# EAGLE design sunclock_back (EAGLE 9.6.2)
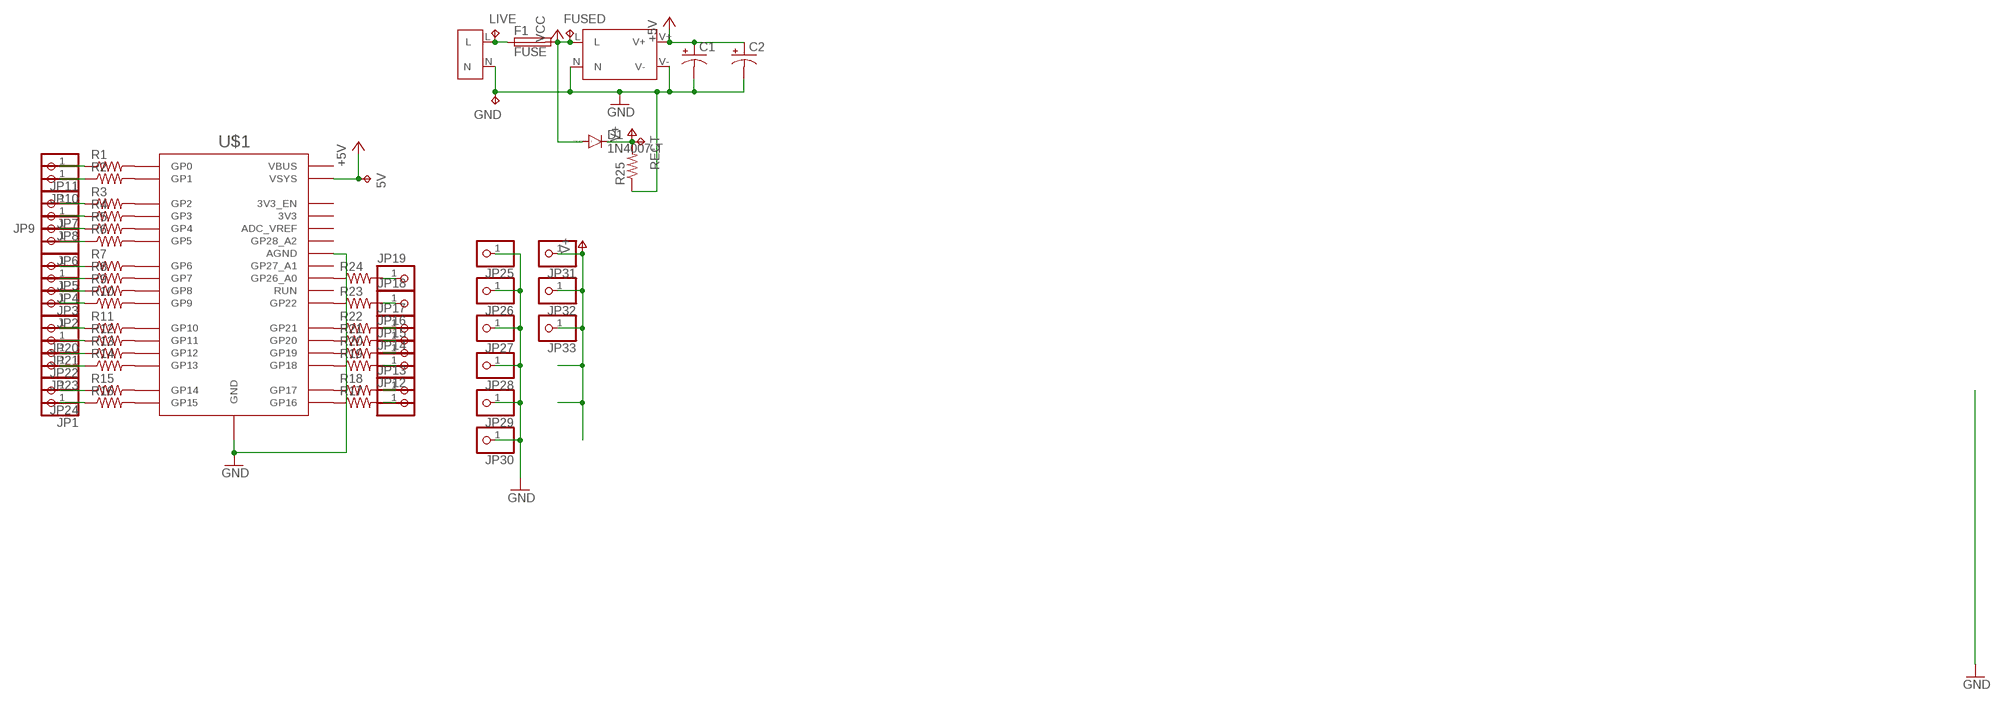
[diagram p0: schematic, sheet 1]

## Parts
5V  TPB2,54  [B2,54]
AC1  AC_IN  [AC_IN]
C1  CPOL-USE3.5-10  [E3,5-10]
C2  CPOL-USE3.5-10  [E3,5-10]
D1  1N4007-T  [DIOAD1140W86L463D236B]
F1  FUSE  [FUSE]
FUSED  TPB2,54  [B2,54]
GND  TPB2,54  [B2,54]
JP1  PINHD-1X1  [1X01]
JP2  PINHD-1X1  [1X01]
JP3  PINHD-1X1  [1X01]
JP4  PINHD-1X1  [1X01]
JP5  PINHD-1X1  [1X01]
JP6  PINHD-1X1  [1X01]
JP7  PINHD-1X1  [1X01]
JP8  PINHD-1X1  [1X01]
JP9  PINHD-1X1  [1X01]
JP10  PINHD-1X1  [1X01]
JP11  PINHD-1X1  [1X01]
JP12  PINHD-1X1  [1X01]
JP13  PINHD-1X1  [1X01]
JP14  PINHD-1X1  [1X01]
JP15  PINHD-1X1  [1X01]
JP16  PINHD-1X1  [1X01]
JP17  PINHD-1X1  [1X01]
JP18  PINHD-1X1  [1X01]
JP19  PINHD-1X1  [1X01]
JP20  PINHD-1X1  [1X01]
JP21  PINHD-1X1  [1X01]
JP22  PINHD-1X1  [1X01]
JP23  PINHD-1X1  [1X01]
JP24  PINHD-1X1  [1X01]
JP25  PINHD-1X1  [1X01]
JP26  PINHD-1X1  [1X01]
JP27  PINHD-1X1  [1X01]
JP28  PINHD-1X1  [1X01]
JP29  PINHD-1X1  [1X01]
JP30  PINHD-1X1  [1X01]
JP31  PINHD-1X1  [1X01]
JP32  PINHD-1X1  [1X01]
JP33  PINHD-1X1  [1X01]
LIVE  TPB2,54  [B2,54]
P1  ACDC  [ACDC]
R1  R-US_0204/7  [0204/7]
R2  R-US_0204/7  [0204/7]
R3  R-US_0204/7  [0204/7]
R4  R-US_0204/7  [0204/7]
R5  R-US_0204/7  [0204/7]
R6  R-US_0204/7  [0204/7]
R7  R-US_0204/7  [0204/7]
R8  R-US_0204/7  [0204/7]
R9  R-US_0204/7  [0204/7]
R10  R-US_0204/7  [0204/7]
R11  R-US_0204/7  [0204/7]
R12  R-US_0204/7  [0204/7]
R13  R-US_0204/7  [0204/7]
R14  R-US_0204/7  [0204/7]
R15  R-US_0204/7  [0204/7]
R16  R-US_0204/7  [0204/7]
R17  R-US_0204/7  [0204/7]
R18  R-US_0204/7  [0204/7]
R19  R-US_0204/7  [0204/7]
R20  R-US_0204/7  [0204/7]
R21  R-US_0204/7  [0204/7]
R22  R-US_0204/7  [0204/7]
R23  R-US_0204/7  [0204/7]
R24  R-US_0204/7  [0204/7]
R25  R-US_0204/7  [0204/7]
RECT  TPB2,54  [B2,54]
U$1  RPI_PICO-TH  [RPI_PICO_TH]

## Nets
+5V: 5V.TP C1.+ C2.+ P1.V+ U$1.VSYS
GND: AC1.N C1.- C2.- GND.TP JP25.1 JP26.1 JP27.1 JP28.1 JP29.1 JP30.1 P1.N P1.V- R25.1 U$1.AGND U$1.GND@1(GND) U$1.GND@2(GND) U$1.GND@3(GND) U$1.GND@4(GND) U$1.GND@6(GND) U$1.GND@7(GND) U$1.GND@8(GND)
N$1: R1.2 U$1.GP0
N$2: R2.2 U$1.GP1
N$3: R3.2 U$1.GP2
N$4: R4.2 U$1.GP3
N$5: R5.2 U$1.GP4
N$6: R6.2 U$1.GP5
N$7: R7.2 U$1.GP6
N$8: R8.2 U$1.GP7
N$9: R9.2 U$1.GP8
N$10: R10.2 U$1.GP9
N$11: R11.2 U$1.GP10
N$12: R12.2 U$1.GP11
N$13: R13.2 U$1.GP12
N$14: R14.2 U$1.GP13
N$15: R15.2 U$1.GP14
N$16: R16.2 U$1.GP15
N$17: R17.1 U$1.GP16
N$18: R18.1 U$1.GP17
N$19: R19.1 U$1.GP18
N$20: R20.1 U$1.GP19
N$21: R21.1 U$1.GP20
N$22: R22.1 U$1.GP21
N$23: R23.1 U$1.GP22
N$24: R24.1 U$1.GP26_A0
N$25: JP9.1 R5.1
N$26: JP8.1 R4.1
N$27: JP7.1 R3.1
N$28: JP10.1 R2.1
N$29: JP11.1 R1.1
N$30: JP6.1 R6.1
N$31: JP5.1 R7.1
N$32: JP4.1 R8.1
N$33: JP3.1 R9.1
N$34: JP2.1 R10.1
N$35: JP1.1 R16.1
N$36: JP20.1 R11.1
N$37: JP21.1 R12.1
N$38: JP22.1 R13.1
N$39: JP23.1 R14.1
N$40: JP24.1 R15.1
N$41: JP12.1 R17.2
N$42: JP13.1 R18.2
N$43: JP14.1 R19.2
N$44: JP15.1 R20.2
N$45: JP16.1 R21.2
N$46: JP17.1 R22.2
N$47: JP18.1 R23.2
N$48: JP19.1 R24.2
N$49: AC1.L F1.P$1 LIVE.TP
V+: D1.1(C) JP31.1 JP32.1 JP33.1 R25.2 RECT.TP
VCC: D1.2(A) F1.P$2 FUSED.TP P1.L
Unconnected: U$1.3V3 U$1.3V3_EN U$1.ADC_VREF U$1.GP27_A1 U$1.GP28_A2 U$1.RUN U$1.VBUS

## Library data of the parts
5V FUSED GND LIVE RECT = testpad:TP: Test pad
AC1 = 1826899:AC_IN
C1 C2 = rcl:CPOL-US: POLARIZED CAPACITOR, American symbol; SPICEPREFIX: C
D1 = 1826899:1N4007-T
F1 = 1826899:FUSE
JP1-JP33 = pinhead:PINHD-1X1: PIN HEADER
P1 = 1826899:ACDC
R1-R25 = rcl:R-US_: RESISTOR, American symbol; SPICEPREFIX: R
U$1 = 1826899:RPI_PICO

## Board
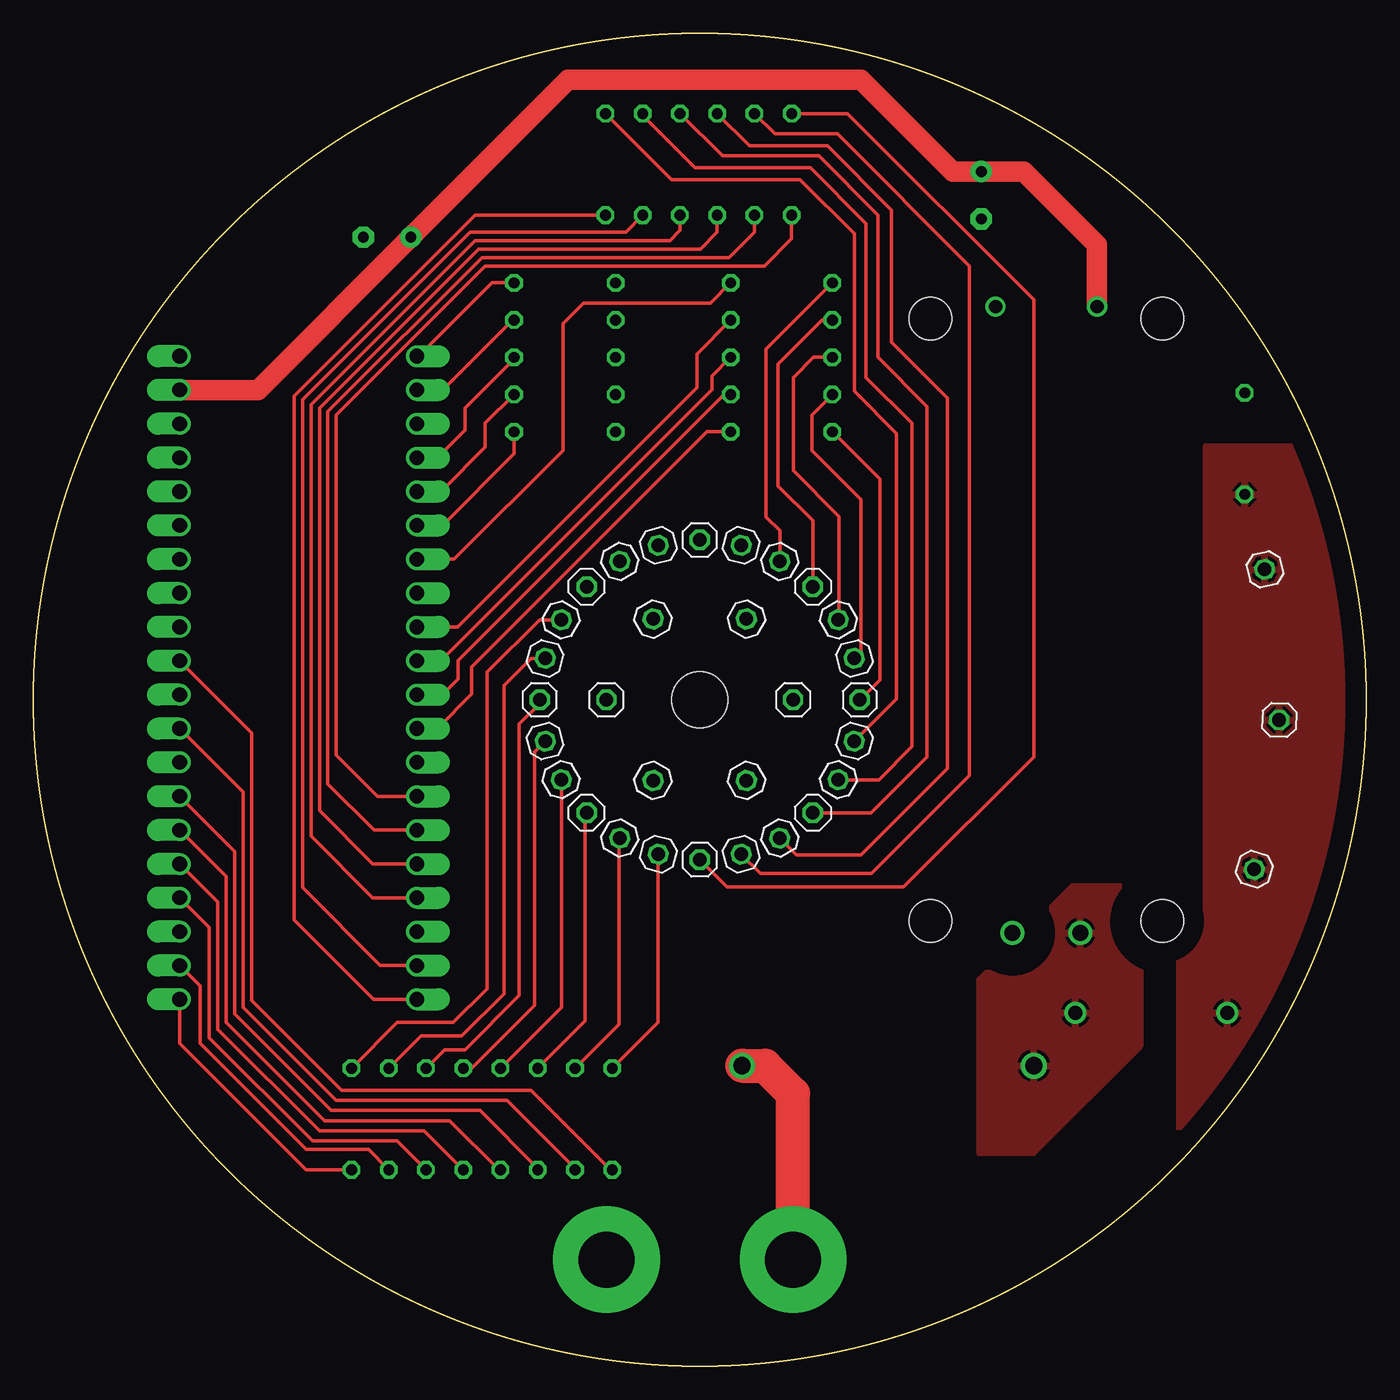
[diagram p1: board, top side]
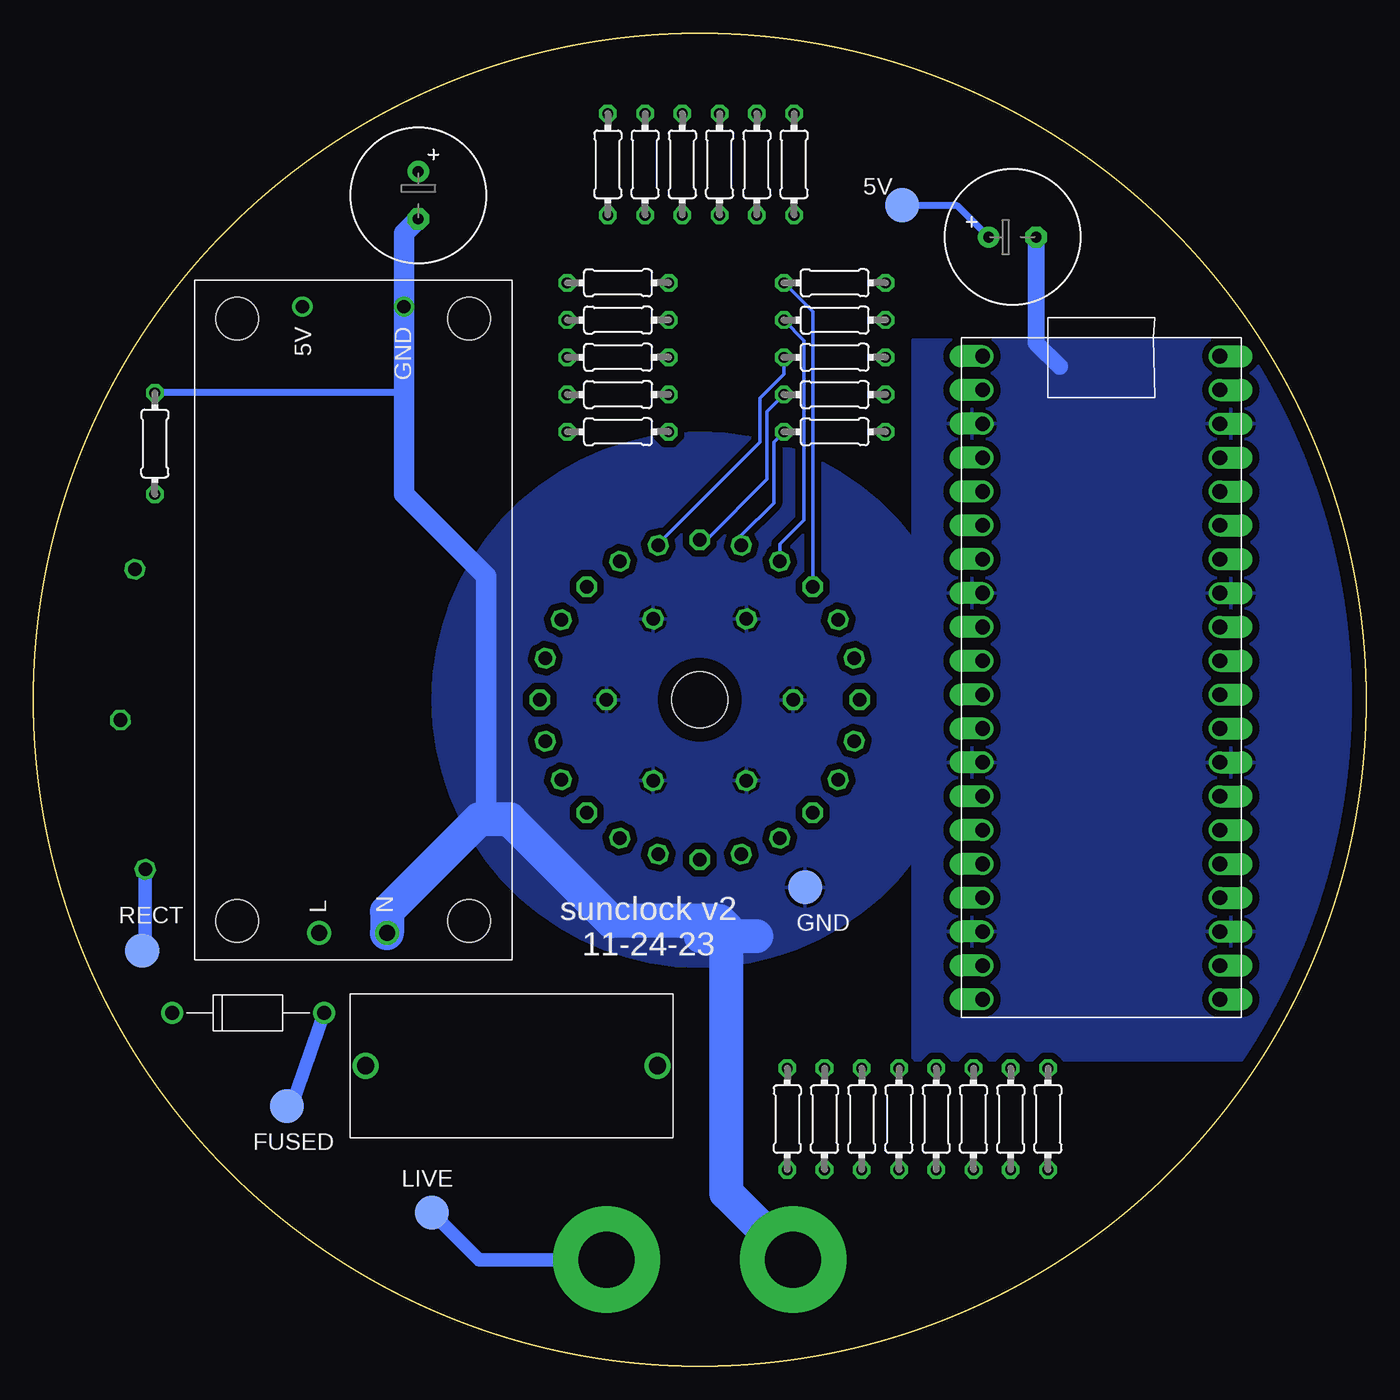
[diagram p2: board, bottom side, seen from below]

Size 100 x 100 mm. Coordinates in mm from the lower left corner, seen from the top.
Outline: circle at 50,50 radius 50
Copper layers (1*16): Top 0.035mm / dielectric 1.5mm / Bottom 0.035mm
Design rules "default": minimum track width 6mil, minimum drill 0.35mm, track to track 6mil, track to pad 6mil, pad to pad 6mil, via to via 6mil, smd to smd 6mil, copper to edge 40mil, drill to drill 6mil, minimum pad ring 10mil, minimum via ring 8mil, stop-mask expansion 4mil, vias tented up to drill 0mil, thermal gap 10mil
Holes 4.2 mm at 50,50

### Footprints (pad centres in the part's own frame; a part is rotated, then mirrored left to right if it is on the bottom)
B2,54 = smd 2.54 x 2.54: TP 0,0
AC_IN = drill 4.2 pad 8: L 7,0; N -7,0
E3,5-10 = drill 0.813 pad 1.6: + -1.778,0 | drill 0.813 pad 1.6 octagon: - 1.778,0
DIOAD1140W86L463D236B = drill 1.064 pad 1.664: 1 -5.701,0; 2 5.701,0
FUSE = drill 1.3: P$1 -10.95,0; P$2 10.95,0
1X01 = drill 1.016 octagon: 1 0,0
ACDC = drill 1.2: L -23.5,2.54; N -23.5,-2.54 | drill 1: V+ 23.5,3.81; V- 23.5,-3.81 | hole 3.2: -22.6,8.7; 22.6,8.7; -22.6,-8.7; 22.6,-8.7
0204/7 = drill 0.813 octagon: 1 -3.81,0; 2 3.81,0
RPI_PICO_TH = drill 1.1 pad 1.6 offset: 3V3 8.89,13.97; 3V3_EN 8.89,16.51; ADC_VREF 8.89,11.43; AGND 8.89,6.35; GND@1 -8.89,19.05; GND@2 -8.89,6.35; GND@3 -8.89,-6.35; GND@4 -8.89,-19.05; GND@6 8.89,-19.05; GND@7 8.89,-6.35; GND@8 8.89,19.05; GP0 -8.89,24.13; GP1 -8.89,21.59; GP2 -8.89,16.51; GP3 -8.89,13.97; GP4 -8.89,11.43; GP5 -8.89,8.89; GP6 -8.89,3.81; GP7 -8.89,1.27; GP8 -8.89,-1.27; GP9 -8.89,-3.81; GP10 -8.89,-8.89; GP11 -8.89,-11.43; GP12 -8.89,-13.97; GP13 -8.89,-16.51; GP14 -8.89,-21.59; GP15 -8.89,-24.13; GP16 8.89,-24.13; GP17 8.89,-21.59; GP18 8.89,-16.51; GP19 8.89,-13.97; GP20 8.89,-11.43; GP21 8.89,-8.89; GP22 8.89,-3.81; GP26_A0 8.89,1.27; GP27_A1 8.89,3.81; GP28_A2 8.89,8.89; RUN 8.89,-1.27; VBUS 8.89,24.13; VSYS 8.89,21.59

### Placement (x,y rotation side)
5V  34.81,87.11 0 bottom
AC1  50,8 0 top
C1  26.54,84.71 0 bottom
C2  71.12,87.85 270 bottom
D1  83.89,26.5 0 bottom
F1  64.12,22.54 180 bottom
FUSED  80.99,19.5 0 bottom
GND  42.1,35.93 0 bottom
JP1  61.59,46.89 345 top
JP2  62,50 0 top
JP3  61.59,53.11 15 top
JP4  60.39,56 30 top
JP5  58.49,58.49 45 top
JP6  56,60.39 60 top
JP7  53.11,61.59 75 top
JP8  50,62 90 top
JP9  46.89,61.59 105 top
JP10  44,60.39 120 top
JP11  41.51,58.49 135 top
JP12  39.61,56 150 top
JP13  38.41,53.11 165 top
JP14  38,50 180 top
JP15  38.41,46.89 195 top
JP16  39.61,44 210 top
JP17  41.51,41.51 225 top
JP18  44,39.61 240 top
JP19  46.89,38.41 255 top
JP20  50,38 270 top
JP21  53.11,38.41 285 top
JP22  56,39.61 300 top
JP23  58.49,41.51 315 top
JP24  60.39,44 330 top
JP25  57,50 0 top
JP26  53.5,56.06 60 top
JP27  46.5,56.06 120 top
JP28  43,50 180 top
JP29  46.5,43.94 240 top
JP30  53.5,43.94 300 top
JP31  91.6,37.28 343 top
JP32  93.47,48.48 358 top
JP33  92.39,59.79 13 top
LIVE  70.1,11.54 0 bottom
P1  76,56 90 bottom
R1  39.88,81.28 0 bottom
R2  39.88,78.49 0 bottom
R3  39.88,75.69 0 bottom
R4  39.88,72.9 0 bottom
R5  39.88,70.1 0 bottom
R6  56.13,81.28 0 bottom
R7  56.13,78.49 0 bottom
R8  56.13,75.69 0 bottom
R9  56.13,72.9 0 bottom
R10  56.13,70.1 0 bottom
R11  56.9,90.17 270 bottom
R12  54.1,90.17 270 bottom
R13  51.31,90.17 270 bottom
R14  48.51,90.17 270 bottom
R15  45.72,90.17 270 bottom
R16  42.93,90.17 270 bottom
R17  23.88,18.54 90 bottom
R18  26.67,18.54 90 bottom
R19  29.46,18.54 90 bottom
R20  32.26,18.54 90 bottom
R21  35.05,18.54 90 bottom
R22  37.85,18.54 90 bottom
R23  40.64,18.54 90 bottom
R24  43.43,18.54 90 bottom
R25  90.88,69.22 270 bottom
RECT  91.83,31.16 0 bottom
U$1  19.87,51.65 0 bottom

### Tracks (layer width: path | path; a pad name or v marks a point on that pad's centre or on a via)
+5V
  Top 1.524: U$1.VSYS 16.86,73.24 C1.+ 40.13,96.52 62.1,96.52 68.99,89.63 C2.+ 74.33,89.63 79.81,84.15 P1.V+
  Bottom 0.508: 5V.TP 30.72,87.11 C1.+
GND
  Bottom 0.508: R25.1 90.85,73.06 72.19,73.06
  Bottom 1.27: C1.- 24.77,76.77 23,75
  Bottom 1.524: 66.55,41.02 66.04,41.53 66.04,59.29 72.19,65.44 72.19,73.06 P1.V- 72.19,85 C2.-
  Bottom 2.54: AC1.N 48.01,13.01 48.01,32.89 48.51,33.4 56.64,33.4 64.26,41.02 66.55,41.02 73.46,34.11 P1.N | 45.77,32.26 49.91,32.26
  pour Bottom (isolate 0.508): 70,50 arc90 50,70 arc90 30,50 arc90 50,30 arc90
  pour Bottom (isolate 0.508): 34,77 -0.13,77 -0.13,23 34,23
N$1
  Top 0.254: U$1.GP0 28.92,75.78 34.42,81.28 R1.2
N$2
  Top 0.254: U$1.GP1 28.8,73.28 30.73,73.28 35.94,78.49 R2.2
N$3
  Top 0.254: U$1.GP2 30.32,68.16 32.38,70.23 32.38,71.88 36.07,75.56 R3.2
N$4
  Top 0.254: U$1.GP3 28.93,65.79 30.73,65.79 33.91,68.96 33.91,70.74 R4.2
N$5
  Top 0.254: U$1.GP4 30.7,63.08 36.07,68.45 R5.2
N$6
  Top 0.254: U$1.GP5 31.59,60.54 39.75,68.71 39.75,78.23 41.27,79.76 50.8,79.76 R6.2
N$7
  Top 0.254: R7.2 49.78,75.95 49.78,75.18 49.78,73.41 31.84,55.46 U$1.GP6
N$8
  Top 0.254: R8.2 50.93,74.3 50.93,73.28 30.57,52.92 U$1.GP7
N$9
  Top 0.254: U$1.GP8 30.7,50.38 31.88,51.56 31.88,52.96 51.82,72.9 R9.2
N$10
  Top 0.254: U$1.GP9 30.32,47.84 32.89,50.42 32.89,52.45 50.55,70.1 R10.2
N$11
  Top 0.254: U$1.GP10 25.82,42.76 22.73,45.85 22.73,71.37 33.91,82.55 54.86,82.55 56.9,84.58 R11.2
N$12
  Top 0.254: U$1.GP11 25.57,40.22 22.1,43.69 22.1,71.63 33.66,83.19 52.2,83.19 54.1,85.09 R12.2
N$13
  Top 0.254: R13.2 51.31,85.09 50.04,83.82 33.4,83.82 21.46,71.88 21.46,41.68 25.46,37.68 U$1.GP12
N$14
  Top 0.254: U$1.GP13 25.46,35.14 20.83,39.77 20.83,72.14 33.15,84.45 47.75,84.45 48.51,85.22 R14.2
N$15
  Top 0.254: R15.2 44.45,85.09 32.77,85.09 20.19,72.52 20.19,35.9 26.04,30.06 U$1.GP14
N$16
  Top 0.254: R16.2 33.15,86.36 19.56,72.77 19.56,33.49 25.53,27.52 U$1.GP15
N$17
  Top 0.254: U$1.GP16 10.98,24.22 20.47,14.73 R17.1
N$18
  Top 0.254: R18.1 25.15,16.26 20.47,16.26 12.51,24.22 12.51,28.54 U$1.GP17
N$19
  Top 0.254: U$1.GP18 13.21,32.92 13.21,24.64 20.95,16.89 27.3,16.89 R19.1
N$20
  Top 0.254: U$1.GP19 13.84,34.82 13.84,25.27 21.46,17.65 29.34,17.65 R20.1
N$21
  Top 0.254: U$1.GP20 14.48,36.73 14.48,25.78 21.84,18.41 31.24,18.41 34.92,14.73 R21.1
N$22
  Top 0.254: U$1.GP21 15.11,38.63 15.11,26.42 22.35,19.18 33.53,19.18 37.85,14.86 R22.1
N$23
  Top 0.254: U$1.GP22 15.75,43.08 15.75,26.92 22.73,19.94 35.56,19.94 40.64,14.86 R23.1
N$24
  Top 0.254: U$1.GP26_A0 16.38,47.52 16.38,27.43 23.11,20.7 37.34,20.7 43.31,14.73 R24.1
N$25
  Bottom 0.254: R5.1 44.45,69.34 44.45,64.77 46.89,62.33 JP9.1
N$26
  Bottom 0.254: R4.1 44.96,71.63 44.96,66.55 49.51,62 JP8.1
N$27
  Bottom 0.254: R3.1 43.69,74.42 45.47,72.64 45.47,69.34 53.11,61.7 JP7.1
N$28
  Bottom 0.254: JP10.1 44,61.66 42.16,63.5 42.16,76.96 R2.1
N$29
  Bottom 0.254: JP11.1 41.52,79.11 R1.1
N$30
  Top 0.254: R6.1 54.98,76.32 54.98,63.69 56,62.68 JP6.1
N$31
  Top 0.254: JP5.1 58.48,63.44 55.88,66.04 55.88,75.18 59.18,78.49 R7.1
N$32
  Top 0.254: R8.1 58.55,75.69 57.02,74.17 57.02,67.18 60.45,63.75 60.45,56.06 JP4.1
N$33
  Top 0.254: R9.1 58.42,71.37 58.42,68.71 62.1,65.02 62.1,53.62 JP3.1
N$34
  Top 0.254: JP2.1 63.5,51.5 63.5,66.55 R10.1
N$35
  Top 0.254: JP1.1 64.77,50.07 64.77,69.98 61.59,73.15 61.59,84.96 57.53,89.03 47.88,89.03 R16.1
N$36
  Top 0.254: JP20.1 52.06,35.94 65.28,35.94 75.06,45.72 75.06,80.01 61.09,93.98 R11.1
N$37
  Top 0.254: JP21.1 54.56,36.96 62.87,36.96 70.23,44.32 70.23,82.55 60.33,92.46 55.63,92.46 R12.1
N$38
  Top 0.254: JP22.1 57.27,38.34 62.09,38.34 68.58,44.83 68.58,72.64 64.39,76.83 64.39,86.74 59.56,91.57 53.72,91.57 R13.1
N$39
  Top 0.254: JP23.1 62.85,41.52 67.06,45.72 67.06,72.01 63.37,75.69 63.37,86.36 58.93,90.81 51.69,90.81 R14.1
N$40
  Top 0.254: JP24.1 63.43,44 65.91,46.48 65.91,70.74 62.48,74.17 62.48,85.72 58.29,89.92 49.66,89.92 45.72,93.85 R15.1
N$41
  Top 0.254: R17.2 27.3,25.78 31.5,25.78 34.04,28.32 34.04,52.07 37.97,56 JP12.1
N$42
  Top 0.254: R18.2 29.08,24.77 32.13,24.77 35.31,27.94 35.31,51.05 37.36,53.11 JP13.1
N$43
  Top 0.254: R19.2 30.86,23.75 32.38,23.75 36.45,27.81 36.45,48.18 38,49.73 JP14.1
N$44
  Top 0.254: JP15.1 37.59,46.08 37.59,27.05 32.89,22.35 R20.2
N$45
  Top 0.254: JP16.1 39.62,43.98 39.62,26.92 R21.2
N$46
  Top 0.254: R22.2 41.4,25.91 41.4,41.4 JP17.1
N$47
  Top 0.254: R23.2 43.94,25.65 43.94,39.55 JP18.1
N$48
  Top 0.254: R24.2 46.86,25.78 46.86,38.38 JP19.1
N$49
  Top 2.54: AC1.L 57,20.45 54.9,22.54 F1.P$1
  Bottom 1.016: AC1.L 66.56,8 LIVE.TP
V+
  Bottom 1.016: JP31.1 91.6,31.39 RECT.TP
  pour Top (isolate 1.524, rank 2): 86,15 86,31 88,33 88,69 96,69 99,59 100,48 98,36 93,24
VCC
  Bottom 1.016: D1.2 80.37,20.28 FUSED.TP
  pour Top (isolate 2.286): 78,36 83,36 83,24 75,16 71,16 71,29

### Text on the board
bNames: sunclock v2 / 11-24-23